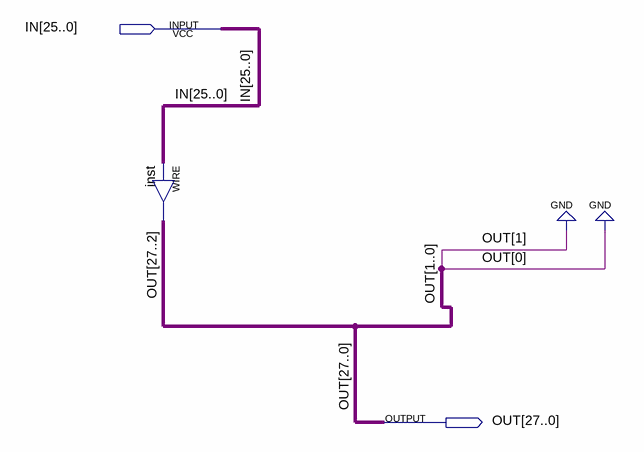
[diagram p0: schematic sheet]
// Quartus schematic shift_left_2_26bit.bdf as structural Verilog: 1 symbols, 2 pins
module shift_left_2_26bit (
  input  [25:0] IN,
  output [27:0] OUT
);

  assign OUT[27:2] = IN;  // WIRE inst

  assign OUT[1:0] = 2'b00;
endmodule
